# Altium project STM32F103RCT6_MCU_LAB.PrjPcb
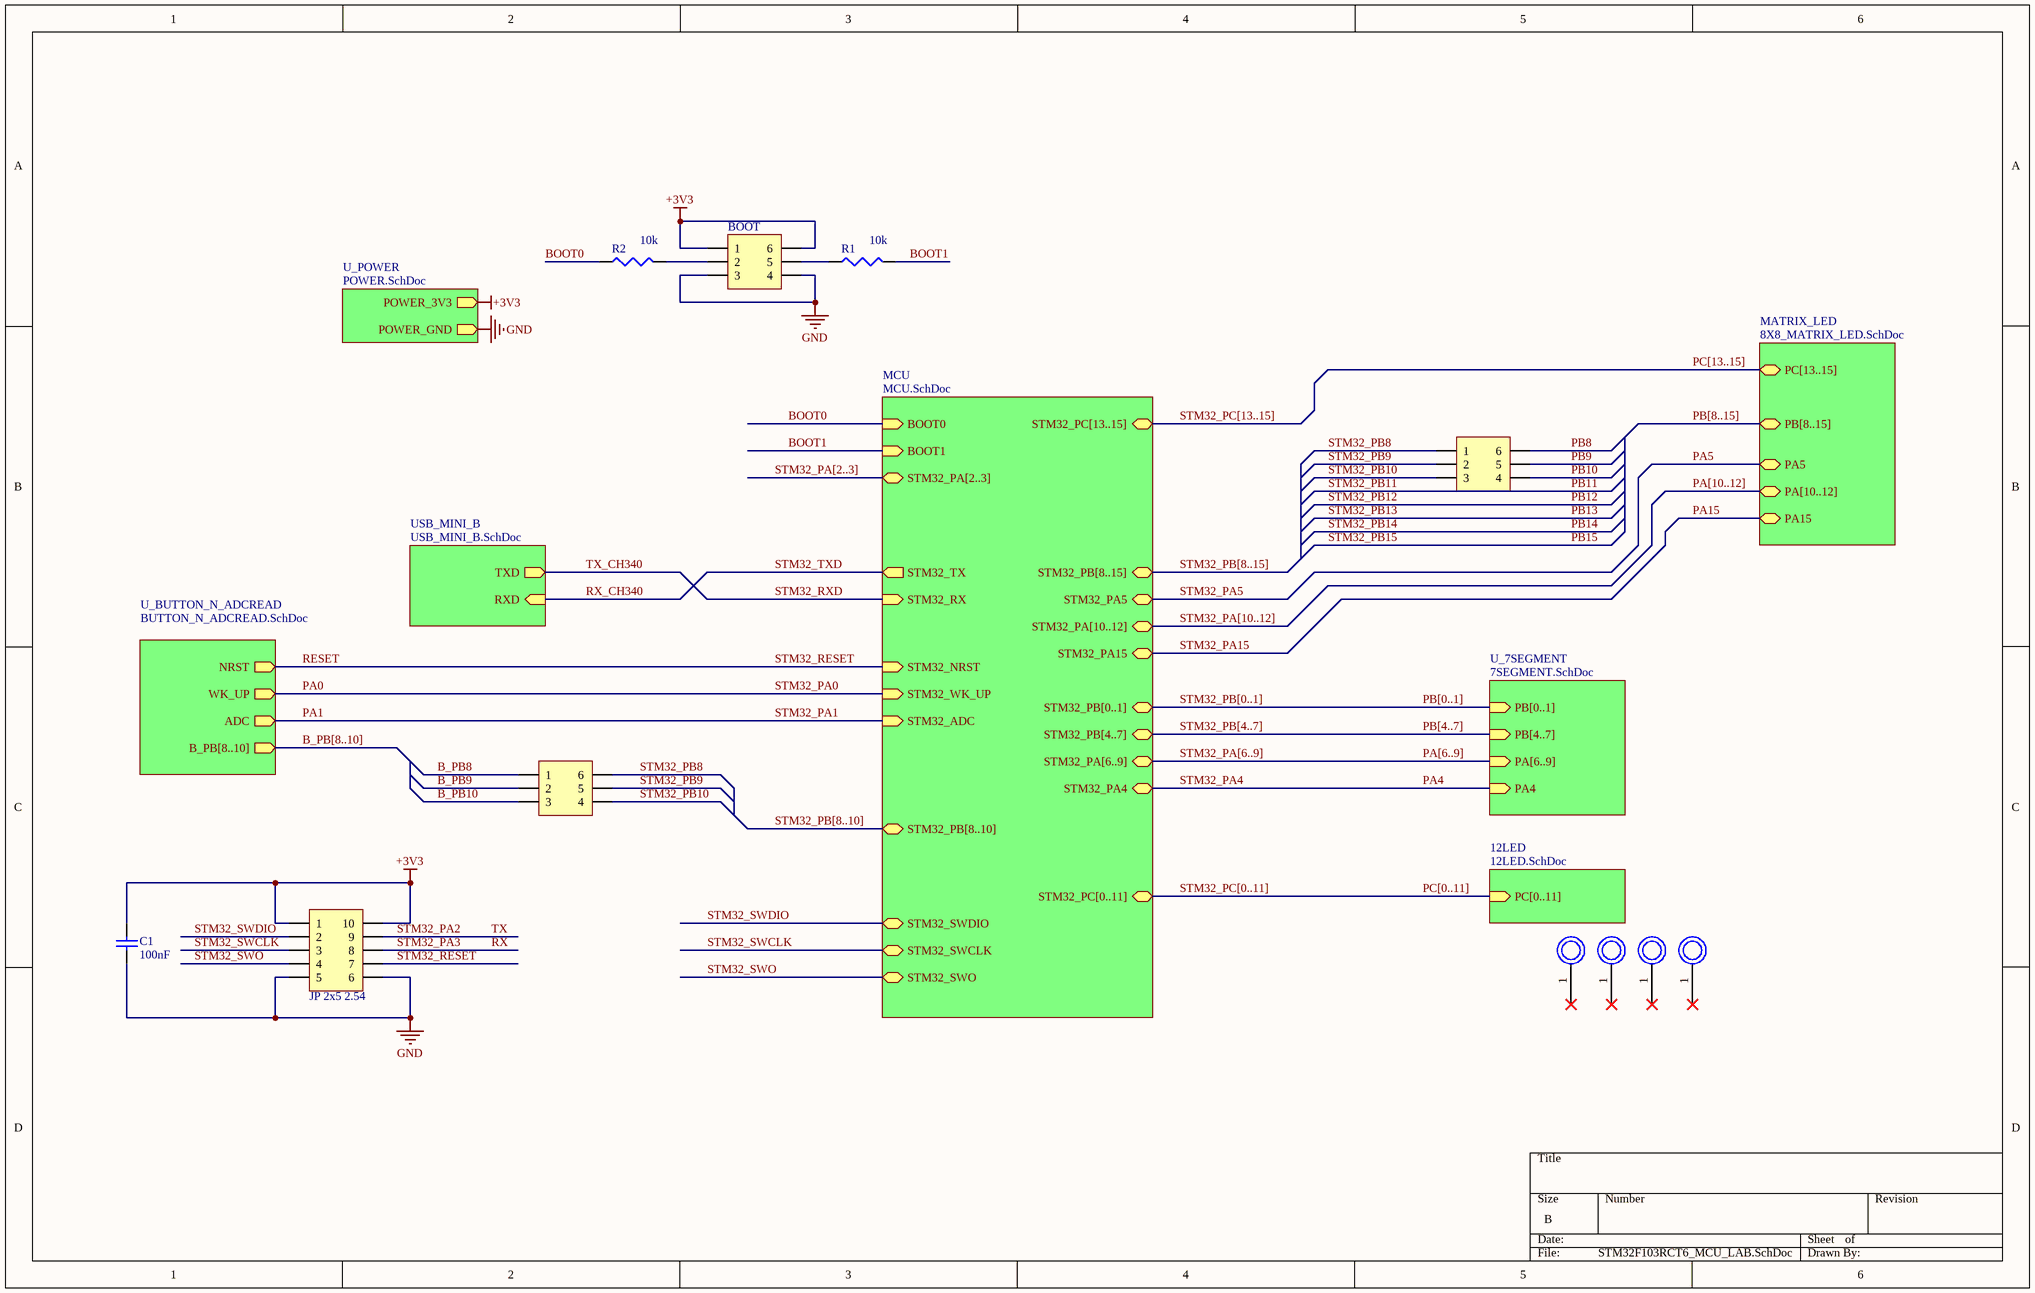
[diagram p0: STM32F103RCT6_MCU_LAB.SchDoc]
CAGE_CODE: ?????; CONTRACT_NUMBER: <CONTRACT NO>; DOC_NO_ASSY_DWG: <ASSY DWG NO>; DOC_NO_BOM: <BOM DOC NO>; DOC_NO_FAB_DWG: <FAB DWG NO>; DOC_NO_SCH_DWG: <SCH DWG NO>; PCB_2_DEC_TOL: +/-.01; PCB_3_DEC_TOL: +/-.010; PCB_ANG_TOL: +/-1/2; PCB_ASSEMBLY_NO: <PCB ASSY NO>; PCB_CHECKER: - -----; PCB_CHECKER_APP_DATE: --/--/----; PCB_DESIGNER: - -----; PCB_DESIGNER_APP_DATE: --/--/----; PCB_DWG_NO: <PCB DWG NO>; PCB_ENGINEER: - -----; PCB_ENGINEER_APP_DATE: --/--/----; PCB_PART_NUMBER: <PCB PN>; PCB_REV: A; SCH_REV: A
8 sheets, 145 parts. Net scope: hierarchical (ports join the sheet entries above them; power ports are global).
Board file: STM32F103RCT6_MCU_LAB_2.PcbDoc
Sheets:
  STM32F103RCT6_MCU_LAB.SchDoc
    MCU = MCU.SchDoc
    USB_MINI_B = USB_MINI_B.SchDoc
    12LED = 12LED.SchDoc
    MATRIX_LED = 8X8_MATRIX_LED.SchDoc
    U_7SEGMENT = 7SEGMENT.SchDoc
    U_BUTTON_N_ADCREAD = BUTTON_N_ADCREAD.SchDoc
    U_POWER = POWER.SchDoc

## Sheet STM32F103RCT6_MCU_LAB.SchDoc
size B; SheetNumber: 1; SheetTotal: 8

### Parts
BOOT  JP 2x3 2.54  [JP 2x3 DT]  (value not drawn)
C1  100nF  [CAPC0805(2012)145_L]
HOLE_M1  HOLE_M3  [HOLE M3]  (value not drawn)
HOLE_M2  HOLE_M3  [HOLE M3]  (value not drawn)
HOLE_M3  HOLE_M3  [HOLE M3]  (value not drawn)
HOLE_M4  HOLE_M3  [HOLE M3]  (value not drawn)
JP1  JP 2x3 2.54  [JP 2x3 DT]  (value not drawn)
JP2  JP 2x5 2.54  [JP 2x5 DT]
JP3  JP 2x3 2.54  [JP 2x3 DT]  (value not drawn)
R1  value 10k  [0805 (2012 Metric)]  (hidden comment: 1k)
R2  10k  [0805 (2012 Metric)]

### Sub-sheets
12LED = 12LED.SchDoc: PC[0..11] (in)
MATRIX_LED = 8X8_MATRIX_LED.SchDoc: PC[13..15] (bidir), PB[8..15] (bidir), PA5 (bidir), PA[10..12] (bidir), PA15 (bidir)
MCU = MCU.SchDoc: STM32_RX (in), STM32_TX (out), STM32_NRST (in), BOOT0 (in), STM32_PA[6..9] (bidir), STM32_PB[8..15] (bidir), STM32_WK_UP (in), STM32_PC[0..11] (bidir), STM32_ADC (in), STM32_PA5 (bidir), STM32_PB[4..7] (bidir), STM32_PA[2..3] (bidir), BOOT1 (in), STM32_PC[13..15] (bidir), STM32_PB[8..10] (bidir), STM32_SWDIO (bidir), STM32_SWCLK (bidir), STM32_PB[0..1] (bidir), STM32_PA[10..12] (bidir), STM32_PA15 (bidir), STM32_PA4 (bidir), STM32_SWO (bidir)
U_7SEGMENT = 7SEGMENT.SchDoc: PA[6..9] (in), PB[0..1] (in), PB[4..7] (in), PA4 (in)
U_BUTTON_N_ADCREAD = BUTTON_N_ADCREAD.SchDoc: B_PB[8..10] (out), NRST (out), WK_UP (out), ADC (out)
U_POWER = POWER.SchDoc: POWER_3V3 (out), POWER_GND (out)
USB_MINI_B = USB_MINI_B.SchDoc: TXD (out), RXD (in)

### Nets
+3V3: BOOT.1 BOOT.6 C1.2 JP2.1 JP2.10 ; sheet U_POWER/POWER_3V3
GND: BOOT.3 BOOT.4 C1.1 JP2.5 JP2.6 ; sheet U_POWER/POWER_GND
B_PB8: JP3.1
B_PB9: JP3.2
B_PB10: JP3.3
BOOT0: R2.1 ; sheet MCU/BOOT0
BOOT1: R1.2 ; sheet MCU/BOOT1
PA0: sheet MCU/STM32_WK_UP, sheet U_BUTTON_N_ADCREAD/WK_UP  [also labelled STM32_PA0]
PA1: sheet MCU/STM32_ADC, sheet U_BUTTON_N_ADCREAD/ADC  [also labelled STM32_PA1]
PA4: sheet MCU/STM32_PA4, sheet U_7SEGMENT/PA4  [also labelled STM32_PA4]
PA5: sheet MCU/STM32_PA5, sheet MATRIX_LED/PA5  [also labelled STM32_PA5]
PA15: sheet MCU/STM32_PA15, sheet MATRIX_LED/PA15  [also labelled STM32_PA15]
PB8: JP1.6
PB9: JP1.5
PB10: JP1.4
RESET: JP2.7 ; sheet MCU/STM32_NRST, sheet U_BUTTON_N_ADCREAD/NRST  [also labelled STM32_RESET]
RX: JP2.8  [also labelled STM32_PA3]
RX_CH340: sheet MCU/STM32_TX, sheet USB_MINI_B/RXD  [also labelled STM32_TXD]
STM32_PA2: JP2.9  [also labelled TX]
STM32_PB8: JP1.1 JP3.6
STM32_PB9: JP1.2 JP3.5
STM32_PB10: JP1.3 JP3.4
STM32_RXD: sheet MCU/STM32_RX, sheet USB_MINI_B/TXD  [also labelled TX_CH340]
STM32_SWCLK: JP2.3 ; sheet MCU/STM32_SWCLK
STM32_SWDIO: JP2.2 ; sheet MCU/STM32_SWDIO
STM32_SWO: JP2.4 ; sheet MCU/STM32_SWO
NetBOOT_2: BOOT.2 R2.2
NetBOOT_5: BOOT.5 R1.1

Not connected (* = marked no-connect by the designer): HOLE_M1 1*; HOLE_M2 1*; HOLE_M3 1*; HOLE_M4 1*

### Buses and harness runs
bus B_PB[8..10] = sheet U_BUTTON_N_ADCREAD/B_PB[8..10]
bus PA[6..9] = STM32_PA[6..9] = sheet MCU/STM32_PA[6..9] = sheet U_7SEGMENT/PA[6..9]
bus PA[10..12] = STM32_PA[10..12] = sheet MATRIX_LED/PA[10..12] = sheet MCU/STM32_PA[10..12]
bus PB[0..1] = STM32_PB[0..1] = sheet MCU/STM32_PB[0..1] = sheet U_7SEGMENT/PB[0..1]
bus PB[4..7] = STM32_PB[4..7] = sheet MCU/STM32_PB[4..7] = sheet U_7SEGMENT/PB[4..7]
bus PB[8..15] = sheet MATRIX_LED/PB[8..15]
bus PC[0..11] = STM32_PC[0..11] = sheet 12LED/PC[0..11] = sheet MCU/STM32_PC[0..11]
bus PC[13..15] = STM32_PC[13..15] = sheet MATRIX_LED/PC[13..15] = sheet MCU/STM32_PC[13..15]
bus STM32_PA[2..3] = sheet MCU/STM32_PA[2..3]
bus STM32_PB[8..10] = sheet MCU/STM32_PB[8..10]
bus STM32_PB[8..15] = sheet MCU/STM32_PB[8..15]

### Library data of the parts
BOOT JP1 JP3 = JP 2x3 2.54 Duc Thang: Cắm; Ten_Linh_Kien: Jump Đôi Đực 2.54MM 2x40P Thẳng 11MM; Don_Vi: Con; Ma_Hang: MH002686; Ghi_Chu: *; Kieu_Chan: *; Chung_Loai: Cắm
C1 = CMP-001-00081-5: Chip Capacitor, 100nF +/-40%, 16V, 0805, Thickness 1.45 mm; Tolerance: 5%; Min Operating Temperature: -55°C; Case/Package: 0805; Pins: 2; Max Operating Temperature: 85°C; Voltage Rating: 16V; Mounting Technology: SMT; Value: 100nF
HOLE_M1-HOLE_M4 = CMP-012-000000-2: Source: HOLE_M3.SchLib; Design Item ID: HOLE_M3
JP2 = JP 2x5 2.54 Duc Thang: Cắm; Ten_Linh_Kien: Jump Đôi Đực 2.54MM 2x40P Thẳng 11MM; Don_Vi: Con; Ma_Hang: MH002686; Ghi_Chu: *; Kieu_Chan: *; Chung_Loai: Cắm
R1 R2 = CMP-009-00179-13: Oreki; ComponentLink1Description: DigiKey; RoHS Compliant: Yes; Mounting Technology: SMT; Pins: 2; Case/Package: Chip
  R2: Value: 10k

## Sheet MCU.SchDoc
size B; SheetNumber: 4; SheetTotal: 8
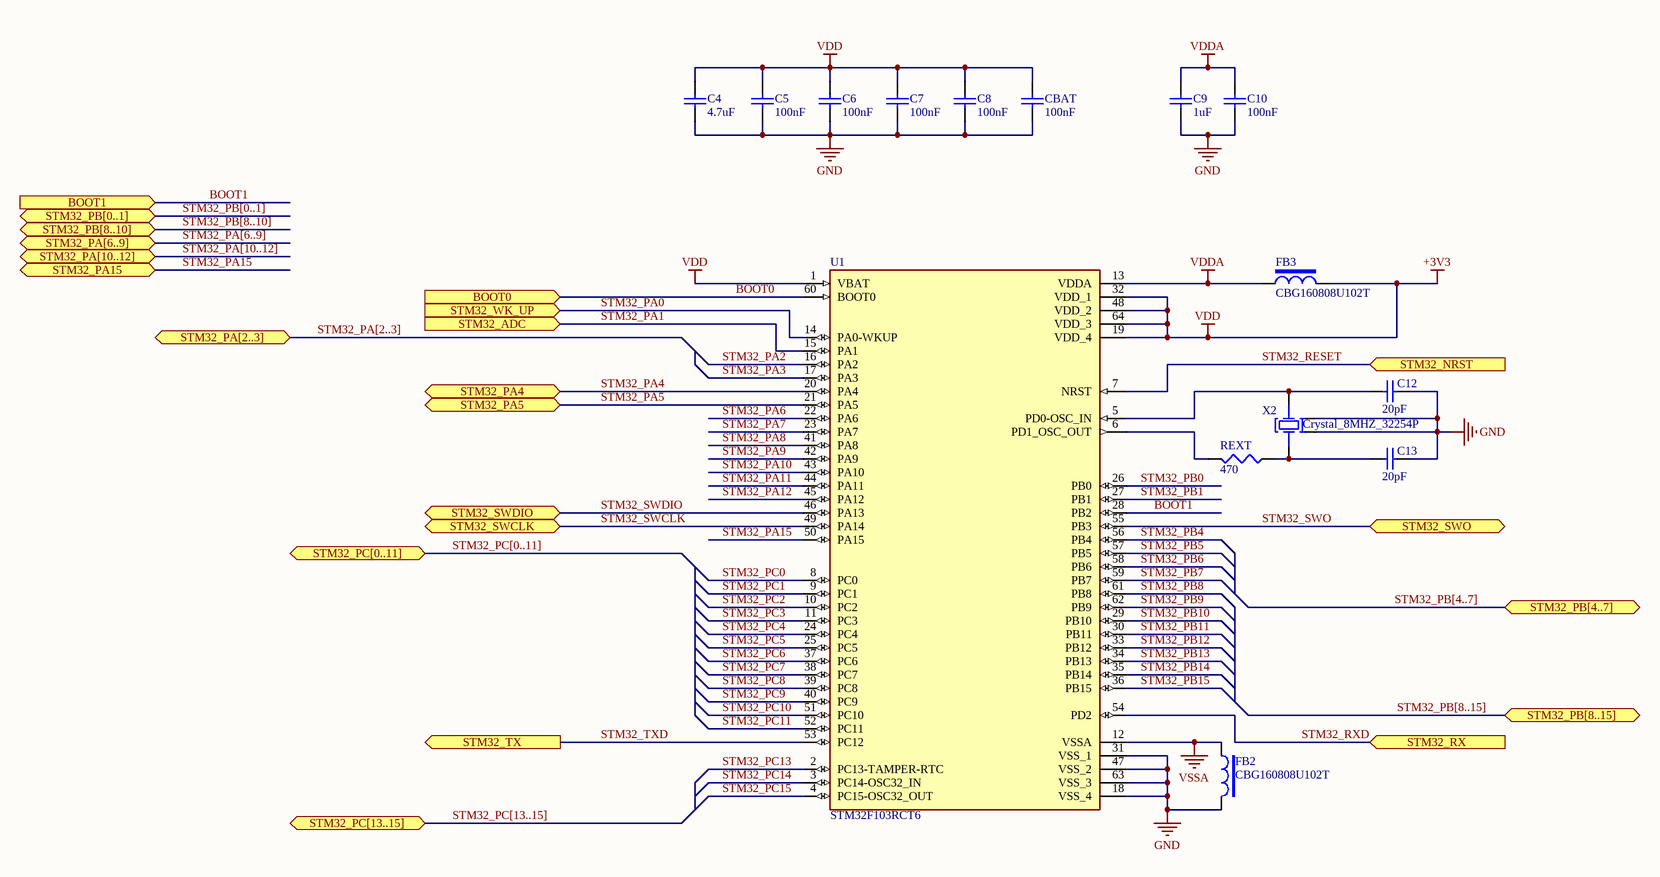
[diagram p1: MCU.SchDoc]

### Parts
C4  value 4.7uF  [CAPC0805(2012)145_L]  (hidden comment: 100nF)
C5  100nF  [CAPC0805(2012)145_L]
C6  100nF  [CAPC0805(2012)145_L]
C7  100nF  [CAPC0805(2012)145_L]
C8  100nF  [CAPC0805(2012)145_L]
C9  value 1uF  [CAPC0805(2012)145_L]  (hidden comment: 100nF)
C10  100nF  [CAPC0805(2012)145_L]
C12  value 20pF  [CAPC0805(2012)145_L]  (hidden comment: 22uF)
C13  value 20pF  [CAPC0805(2012)145_L]  (hidden comment: 22uF)
CBAT  100nF  [CAPC0805(2012)145_L]
FB2  CBG160808U102T  [0603]
FB3  CBG160808U102T  [0603]
REXT  value 470  [0805 (2012 Metric)]  (hidden comment: 220)
U1  STM32F103RCT6  [QFP50P1200X1200X160-64N]
X2  Crystal_8MHZ_32254P  [4-SMD, No Lead (3.2mm x 2.5mm)]

### Ports
BOOT0 (in), BOOT1 (in), STM32_ADC (in), STM32_NRST (in), STM32_PA4 (bidir), STM32_PA5 (bidir), STM32_PA15 (bidir), STM32_PA[2..3] (bidir), STM32_PA[6..9] (bidir), STM32_PA[10..12] (bidir), STM32_PB[0..1] (bidir), STM32_PB[4..7] (bidir), STM32_PB[8..10] (bidir), STM32_PB[8..15] (bidir), STM32_PC[0..11] (bidir), STM32_PC[13..15] (bidir), STM32_RX (in), STM32_SWCLK (bidir), STM32_SWDIO (bidir), STM32_SWO (bidir), STM32_TX (out), STM32_WK_UP (in)

### Nets
+3V3: C4.2 C5.2 C6.2 C7.2 C8.2 CBAT.2 FB3.2 U1.1(VBAT) U1.19(VDD_4) U1.32(VDD_1) U1.48(VDD_2) U1.64(VDD_3)  [also labelled VDD]
GND: C4.1 C5.1 C6.1 C7.1 C8.1 C9.1 C10.1 C12.2 C13.2 CBAT.1 FB2.2 U1.18(VSS_4) U1.31(VSS_1) U1.47(VSS_2) U1.63(VSS_3) X2.2(GND) X2.4(GND)
VDDA: C9.2 C10.2 FB3.1 U1.13(VDDA)
VSSA: FB2.1 U1.12(VSSA)
BOOT0: U1.60(BOOT0) ; port BOOT0
BOOT1: U1.28(PB2) ; port BOOT1
STM32_PA0: U1.14(PA0-WKUP) ; port STM32_WK_UP  [project net PA0]
STM32_PA1: U1.15(PA1) ; port STM32_ADC  [project net PA1]
STM32_PA2: U1.16(PA2)
STM32_PA3: U1.17(PA3)  [project net RX]
STM32_PA4: U1.20(PA4) ; port STM32_PA4  [project net PA4]
STM32_PA5: U1.21(PA5) ; port STM32_PA5  [project net PA5]
STM32_PA6: U1.22(PA6)  [project net PA6]
STM32_PA7: U1.23(PA7)  [project net PA7]
STM32_PA8: U1.41(PA8)  [project net PA8]
STM32_PA9: U1.42(PA9)  [project net PA9]
STM32_PA10: U1.43(PA10)  [project net PA10]
STM32_PA11: U1.44(PA11)  [project net PA11]
STM32_PA12: U1.45(PA12)  [project net PA12]
STM32_PA15: U1.50(PA15) ; port STM32_PA15  [project net PA15]
STM32_PB0: U1.26(PB0)  [project net PB0]
STM32_PB1: U1.27(PB1)  [project net PB1]
STM32_PB4: U1.56(PB4)  [project net PB4]
STM32_PB5: U1.57(PB5)  [project net PB5]
STM32_PB6: U1.58(PB6)  [project net PB6]
STM32_PB7: U1.59(PB7)  [project net PB7]
STM32_PB8: U1.61(PB8)
STM32_PB9: U1.62(PB9)
STM32_PB10: U1.29(PB10)
STM32_PB11: U1.30(PB11)  [project net PB11]
STM32_PB12: U1.33(PB12)  [project net PB12]
STM32_PB13: U1.34(PB13)  [project net PB13]
STM32_PB14: U1.35(PB14)  [project net PB14]
STM32_PB15: U1.36(PB15)  [project net PB15]
STM32_PC0: U1.8(PC0)  [project net PC0]
STM32_PC1: U1.9(PC1)  [project net PC1]
STM32_PC2: U1.10(PC2)  [project net PC2]
STM32_PC3: U1.11(PC3)  [project net PC3]
STM32_PC4: U1.24(PC4)  [project net PC4]
STM32_PC5: U1.25(PC5)  [project net PC5]
STM32_PC6: U1.37(PC6)  [project net PC6]
STM32_PC7: U1.38(PC7)  [project net PC7]
STM32_PC8: U1.39(PC8)  [project net PC8]
STM32_PC9: U1.40(PC9)  [project net PC9]
STM32_PC10: U1.51(PC10)  [project net PC10]
STM32_PC11: U1.52(PC11)  [project net PC11]
STM32_PC13: U1.2(PC13-TAMPER-RTC)  [project net PC13]
STM32_PC14: U1.3(PC14-OSC32_IN)  [project net PC14]
STM32_PC15: U1.4(PC15-OSC32_OUT)  [project net PC15]
STM32_RESET: U1.7(NRST) ; port STM32_NRST  [project net RESET]
STM32_RXD: U1.54(PD2) ; port STM32_RX
STM32_SWCLK: U1.49(PA14) ; port STM32_SWCLK
STM32_SWDIO: U1.46(PA13) ; port STM32_SWDIO
STM32_SWO: U1.55(PB3) ; port STM32_SWO
STM32_TXD: U1.53(PC12) ; port STM32_TX  [project net RX_CH340]
NetC12_1: C12.1 U1.5(PD0-OSC_IN) X2.3
NetC13_1: C13.1 REXT.1 X2.1
NetREXT_2: REXT.2 U1.6(PD1_OSC_OUT)

### Buses and harness runs
bus STM32_PA[2..3] = port STM32_PA[2..3]
bus STM32_PA[6..9] = port STM32_PA[6..9]
bus STM32_PA[10..12] = port STM32_PA[10..12]
bus STM32_PB[0..1] = port STM32_PB[0..1]
bus STM32_PB[4..7] = port STM32_PB[4..7]
bus STM32_PB[8..10] = port STM32_PB[8..10]
bus STM32_PB[8..15] = port STM32_PB[8..15]
bus STM32_PC[0..11] = port STM32_PC[0..11]
bus STM32_PC[13..15] = port STM32_PC[13..15]

### Library data of the parts
C4-C10 CBAT = CMP-001-00081-5: as C1 on sheet STM32F103RCT6_MCU_LAB; Min Operating Temperature: -55°C; Case/Package: 0805; Pins: 2; Max Operating Temperature: 85°C; Voltage Rating: 16V; Mounting Technology: SMT
  C5-C8 C10 CBAT: Value: 100nF
C12 C13 = CMP-001-00081-5: Chip Capacitor, 22µF +/-40%, 16V, 0805, Thickness 1.45 mm; Tolerance: 5%; Min Operating Temperature: -55°C; Case/Package: 0805; Pins: 2; Max Operating Temperature: 85°C; Voltage Rating: 16V; Mounting Technology: SMT
FB2 FB3 = CMP-005-00013-18: Oreki; ComponentLink1Description: DigiKey; JLCPCB Part #: C98501; Source: components.SchLib
REXT = CMP-009-00179-13: Oreki; ComponentLink1Description: DigiKey; RoHS Compliant: Yes; Mounting Technology: SMT; Pins: 2; Case/Package: Chip
U1 = CMP-031-00008-7: ARMÂ® CortexÂ®-M3 STM32F1 Microcontroller IC 32-Bit 72MHz 256KB (256K x 8) FLASH 64-LQFP (10x10); MF: STMicroelectronics; Check_prices: https://www.snapeda.com/parts/STM32F103RCT6/STMicroelectronics/view-part/?ref=eda; Value: *; Design Item ID: STM32F103RCT6; Availability: In Stock; Source: STM32F103RCT6.SchLib; Purchase-URL: https://pricing.snapeda.com/search/part/STM32F103RCT6/?ref=eda; Component Type: Standard; SnapEDA_Link: https://www.snapeda.com/parts/STM32F103RCT6/STMicroelectronics/view-part/?ref=snap; Price: None; Pins: 64; MP: STM32F103RCT6; Case/Package: LQFP-64 STMicroelectronics; JLCPCB Part #: C8323
X2 = CMP-003-00036-1: SMD3225-4P; ComponentLink1Description: DigiKey; JLCPCB Part #: C2682774

## Sheet USB_MINI_B.SchDoc
size A4; SheetNumber: 2; SheetTotal: 8
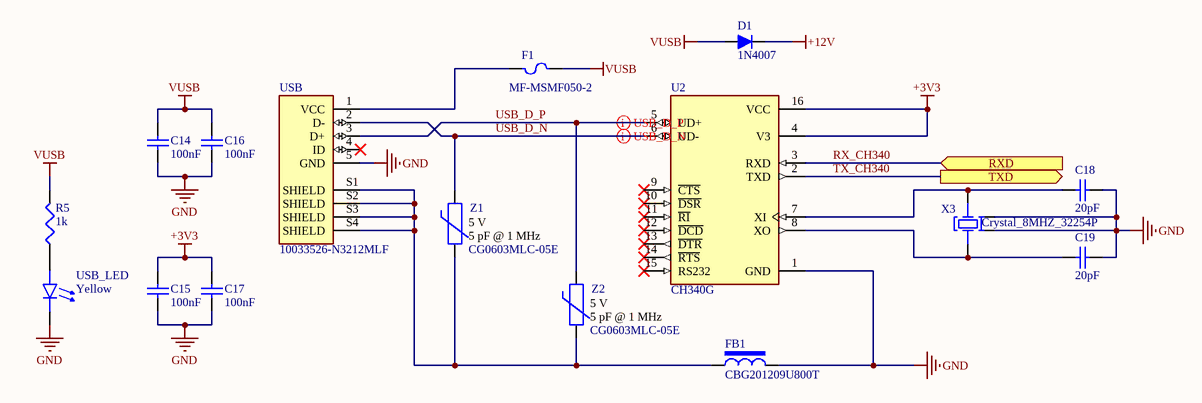
[diagram p2: USB_MINI_B.SchDoc]

### Parts
C14  100nF  [CAPC0805(2012)145_L]
C15  100nF  [CAPC0805(2012)145_L]
C16  100nF  [CAPC0805(2012)145_L]
C17  100nF  [CAPC0805(2012)145_L]
C18  value 20pF  [CAPC0805(2012)145_L]  (hidden comment: 22uF)
C19  value 20pF  [CAPC0805(2012)145_L]  (hidden comment: 22uF)
D1  1N4007  [1N4007]
F1  MF-MSMF050-2  [1812 (4532 Metric), Concave]
FB1  CBG201209U800T  [0805 (2012 Metric)]
R5  1k  [0805 (2012 Metric)]
U2  CH340G  [SOIC127P600X180-16N]
USB  10033526-N3212MLF  [AMPHENOL_10033526-N3212MLF]
USB_LED  Yellow  [0805 (2012 Metric) Yellow]
X3  Crystal_8MHZ_32254P  [4-SMD, No Lead (3.2mm x 2.5mm)]
Z1  Capacitance @ Frequency: 5 pF @ 1 MHz  Maximum DC Volts: 5 V  [0603 (1608 Metric)]  (hidden comment: CG0603MLC-05E)
Z2  Capacitance @ Frequency: 5 pF @ 1 MHz  Maximum DC Volts: 5 V  [0603 (1608 Metric)]  (hidden comment: CG0603MLC-05E)

### Ports
RXD (in), TXD (out)

### Nets
+3V3: C15.2 C17.2 U2.4(V3) U2.16(VCC)
+12V: D1.1
GND: C14.1 C15.1 C16.1 C17.1 C18.2 C19.2 FB1.2 U2.1(GND) USB.5(GND) USB_LED.1(K) X3.2(GND) X3.4(GND)
VUSB: C14.2 C16.2 D1.2 F1.2 R5.2
RX_CH340: U2.3(RXD) ; port RXD
TX_CH340: U2.2(TXD) ; port TXD  [project net STM32_RXD]
USB_D_N: U2.6(UD-) USB.2(D-) Z1.1
USB_D_P: U2.5(UD+) USB.3(D+) Z2.1
NetC18_1: C18.1 U2.7(XI) X3.3
NetC19_1: C19.1 U2.8(XO) X3.1
NetF1_1: F1.1 USB.1(VCC)
NetFB1_1: FB1.1 USB.S1(SHIELD) USB.S2(SHIELD) USB.S3(SHIELD) USB.S4(SHIELD) Z1.2 Z2.2
NetR5_1: R5.1 USB_LED.2(A)

Not connected (* = marked no-connect by the designer): U2 9(~{CTS})* 10(~{DSR})* 11(~{RI})* 12(~{DCD})* 13(~{DTR})* 14(~{RTS})* 15(RS232)*; USB 4(ID)*

### Layout directives
differential pair: USB_D_N, USB_D_P

### Library data of the parts
C14-C17 = CMP-001-00081-5: as C1 on sheet STM32F103RCT6_MCU_LAB; Min Operating Temperature: -55°C; Case/Package: 0805; Pins: 2; Max Operating Temperature: 85°C; Voltage Rating: 16V; Mounting Technology: SMT; Value: 100nF
C18 C19 = CMP-001-00081-5: as C12 on sheet MCU; Min Operating Temperature: -55°C; Case/Package: 0805; Pins: 2; Max Operating Temperature: 85°C; Voltage Rating: 16V; Mounting Technology: SMT
D1 = CMP-004-00031-1: Design Item ID: diode; Source: components.SchLib; JLCPCB Part #: C95872
F1 = CMP-006-000000-1: https://www.thegioiic.com/mf-msmf050-2-cau-chi-tu-phuc-hoi-1812-15v-0-5a; Voltage - Max: 15V; Current - Hold (Ih) (Max): 500 mA; Current - Trip (It): 1 A; Current - Max: 100 A; Time to Trip: 150 ms; Resistance - Initial (Ri) (Min): 150 mOhms; Resistance - Post Trip (R1) (Max): 1 Ohms; Part Number: MF-MSMF050-2; JLCPCB Part #: C17313; Design Item ID: CMP-005-00015-2; Pin Count: 2; Component Type: Fuses; Source: [CO2037] Power Consumption Calculator Arduino Board.SCHLIB
FB1 = CMP-005-00013-18: ComponentLink1Description: DigiKey; JLCPCB Part #: C139149; Source: components.SchLib; Design Item ID: CBG201209U800T
R5 = CMP-009-00179-13: Oreki; Value: 1k; ComponentLink1Description: DigiKey; RoHS Compliant: Yes; Mounting Technology: SMT; Pins: 2; Case/Package: Chip
U2 = CMP-012-000000-5: USB Interface Integrated Circuit; MF: WCH; Source: CH340G.SchLib; Availability: Not in stock; Component Type: Standard; Pin Count: 16; Price: None; Value: *; MP: Ch340G; Package: None; SnapEDA_Link: https://www.snapeda.com/parts/Ch340G/WCH/view-part/?ref=snap; Check_prices: https://www.snapeda.com/parts/Ch340G/WCH/view-part/?ref=eda; Design Item ID: CH340G
USB = CMP-037-000000-2: USB - mini B Receptacle Connector 5 Position Surface Mount, Right Angle; MF: Amphenol ICC; Value: *; Mouser-Purchase-URL: https://snapeda.com/shop?store=Mouser&id=47487; Package: None; Availability: Good; Component Type: Standard; MP: 10033526-N3212MLF; Source: 10033526-N3212MLF.SchLib; Price: None; Design Item ID: 10033526-N3212MLF; Pin Count: 9; Arrow_Electronics-Purchase-URL: https://snapeda.com/shop?store=Arrow+Electronics&id=47487; SnapEDA_Link: https://www.snapeda.com/parts/10033526-N3212MLF/Amphenol%20FCI/view-part/47487/?ref=snap; JLCPCB Part #: C2681563
USB_LED = CMP-007-00046-3: Oreki; JLCPCB Part #: C2296; ComponentLink1Description: DigiKey
X3 = CMP-003-00036-1: SMD3225-4P; ComponentLink1Description: DigiKey; JLCPCB Part #: C2682774
Z1 Z2 = CMP-009-000000-1: chua co link, xem tam: https://www.thegioiic.com/cg0603mlc-05e; Parameter 1: C840634; Energy: -; Part Number: CG0603MLC-05E; Design Item ID: CMP-001-00088-1; Source: [CO2037] Power Consumption Calculator Arduino Board.SCHLIB; Component Type: Capacitors; Pin Count: 2; JLCPCB Part #: C840634

## Sheet 12LED.SchDoc
size B; SheetNumber: 7; SheetTotal: 8
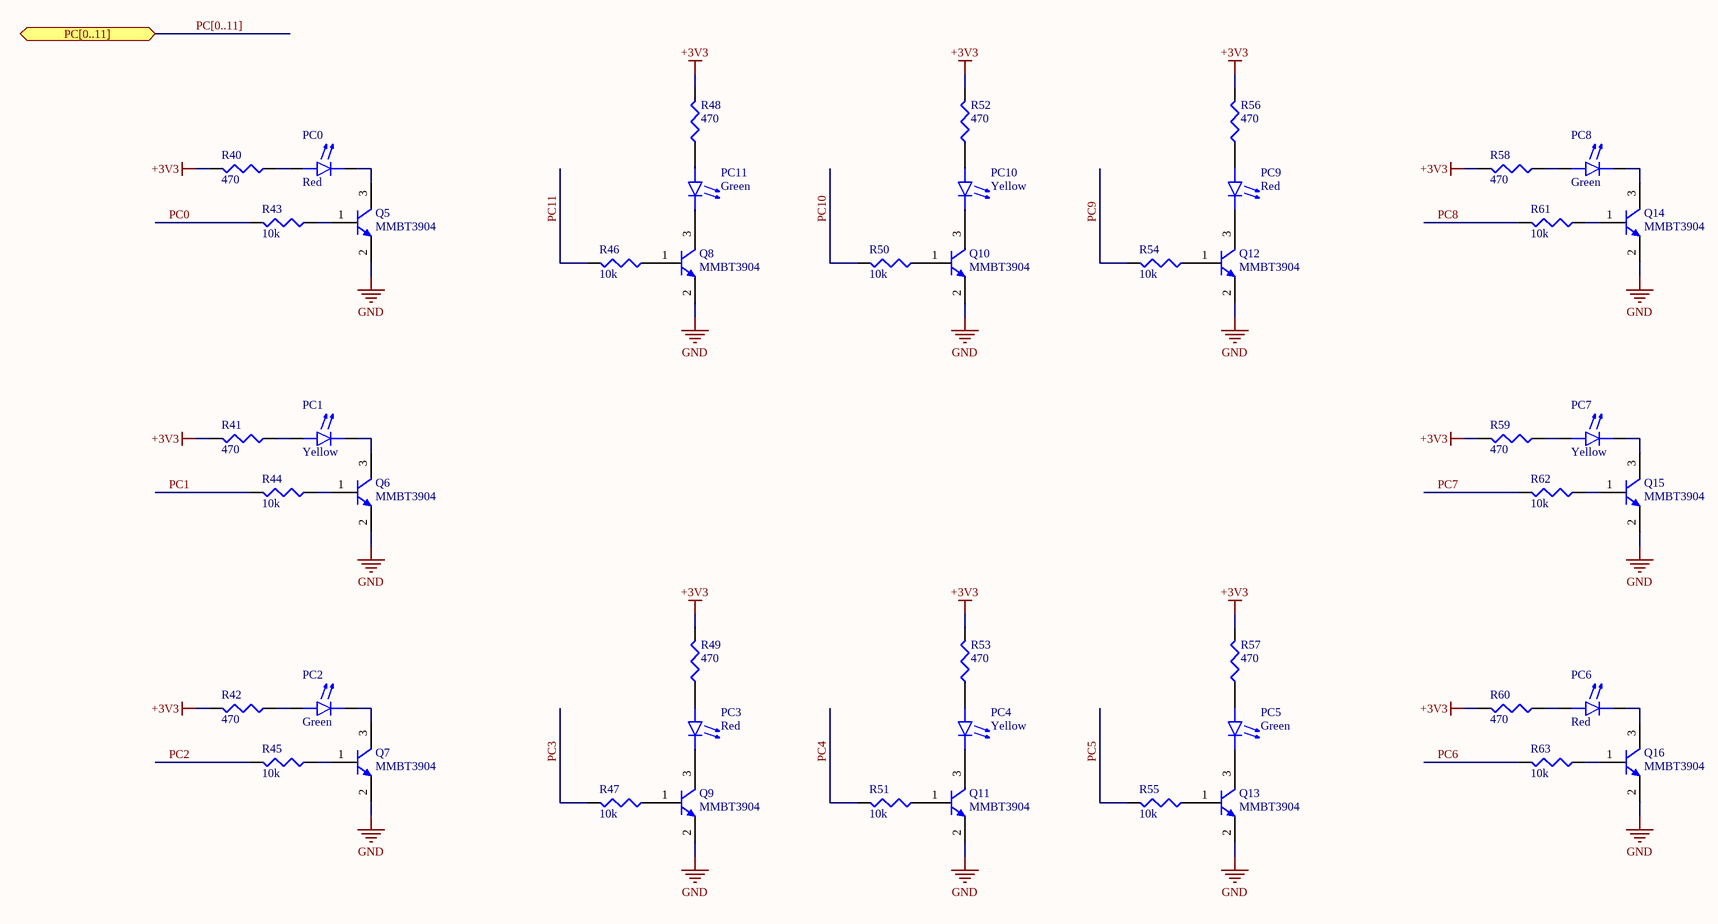
[diagram p3: 12LED.SchDoc]

### Parts
PC0  Red  [0805 (2012 Metric) Red]
PC1  Yellow  [0805 (2012 Metric) Yellow]
PC2  Green  [0805 (2012 Metric) Green]
PC3  Red  [0805 (2012 Metric) Red]
PC4  Yellow  [0805 (2012 Metric) Yellow]
PC5  Green  [0805 (2012 Metric) Green]
PC6  Red  [0805 (2012 Metric) Red]
PC7  Yellow  [0805 (2012 Metric) Yellow]
PC8  Green  [0805 (2012 Metric) Green]
PC9  Red  [0805 (2012 Metric) Red]
PC10  Yellow  [0805 (2012 Metric) Yellow]
PC11  Green  [0805 (2012 Metric) Green]
Q5  MMBT3904  [FAIR-SOT23-3_V]
Q6  MMBT3904  [FAIR-SOT23-3_V]
Q7  MMBT3904  [FAIR-SOT23-3_V]
Q8  MMBT3904  [FAIR-SOT23-3_V]
Q9  MMBT3904  [FAIR-SOT23-3_V]
Q10  MMBT3904  [FAIR-SOT23-3_V]
Q11  MMBT3904  [FAIR-SOT23-3_V]
Q12  MMBT3904  [FAIR-SOT23-3_V]
Q13  MMBT3904  [FAIR-SOT23-3_V]
Q14  MMBT3904  [FAIR-SOT23-3_V]
Q15  MMBT3904  [FAIR-SOT23-3_V]
Q16  MMBT3904  [FAIR-SOT23-3_V]
R40  value 470  [0805 (2012 Metric)]  (hidden comment: 220)
R41  value 470  [0805 (2012 Metric)]  (hidden comment: 220)
R42  value 470  [0805 (2012 Metric)]  (hidden comment: 220)
R43  value 10k  [0805 (2012 Metric)]  (hidden comment: 3k3)
R44  value 10k  [0805 (2012 Metric)]  (hidden comment: 3k3)
R45  value 10k  [0805 (2012 Metric)]  (hidden comment: 3k3)
R46  value 10k  [0805 (2012 Metric)]  (hidden comment: 3k3)
R47  value 10k  [0805 (2012 Metric)]  (hidden comment: 3k3)
R48  value 470  [0805 (2012 Metric)]  (hidden comment: 220)
R49  value 470  [0805 (2012 Metric)]  (hidden comment: 220)
R50  value 10k  [0805 (2012 Metric)]  (hidden comment: 3k3)
R51  value 10k  [0805 (2012 Metric)]  (hidden comment: 3k3)
R52  value 470  [0805 (2012 Metric)]  (hidden comment: 220)
R53  value 470  [0805 (2012 Metric)]  (hidden comment: 220)
R54  value 10k  [0805 (2012 Metric)]  (hidden comment: 3k3)
R55  value 10k  [0805 (2012 Metric)]  (hidden comment: 3k3)
R56  value 470  [0805 (2012 Metric)]  (hidden comment: 220)
R57  value 470  [0805 (2012 Metric)]  (hidden comment: 220)
R58  value 470  [0805 (2012 Metric)]  (hidden comment: 220)
R59  value 470  [0805 (2012 Metric)]  (hidden comment: 220)
R60  value 470  [0805 (2012 Metric)]  (hidden comment: 220)
R61  value 10k  [0805 (2012 Metric)]  (hidden comment: 3k3)
R62  value 10k  [0805 (2012 Metric)]  (hidden comment: 3k3)
R63  value 10k  [0805 (2012 Metric)]  (hidden comment: 3k3)

### Ports
PC[0..11] (bidir)

### Nets
+3V3: R40.2 R41.2 R42.2 R48.2 R49.2 R52.2 R53.2 R56.2 R57.2 R58.2 R59.2 R60.2
GND: Q5.2(E) Q6.2(E) Q7.2(E) Q8.2(E) Q9.2(E) Q10.2(E) Q11.2(E) Q12.2(E) Q13.2(E) Q14.2(E) Q15.2(E) Q16.2(E)
PC0: R43.2
PC1: R44.2
PC2: R45.2
PC3: R47.2
PC4: R51.2
PC5: R55.2
PC6: R63.2
PC7: R62.2
PC8: R61.2
PC9: R54.2
PC10: R50.2
PC11: R46.2
NetPC0_1: PC0.1(K) Q5.3(C)
NetPC0_2: PC0.2(A) R40.1
NetPC1_1: PC1.1(K) Q6.3(C)
NetPC1_2: PC1.2(A) R41.1
NetPC2_1: PC2.1(K) Q7.3(C)
NetPC2_2: PC2.2(A) R42.1
NetPC3_1: PC3.1(K) Q9.3(C)
NetPC3_2: PC3.2(A) R49.1
NetPC4_1: PC4.1(K) Q11.3(C)
NetPC4_2: PC4.2(A) R53.1
NetPC5_1: PC5.1(K) Q13.3(C)
NetPC5_2: PC5.2(A) R57.1
NetPC6_1: PC6.1(K) Q16.3(C)
NetPC6_2: PC6.2(A) R60.1
NetPC7_1: PC7.1(K) Q15.3(C)
NetPC7_2: PC7.2(A) R59.1
NetPC8_1: PC8.1(K) Q14.3(C)
NetPC8_2: PC8.2(A) R58.1
NetPC9_1: PC9.1(K) Q12.3(C)
NetPC9_2: PC9.2(A) R56.1
NetPC10_1: PC10.1(K) Q10.3(C)
NetPC10_2: PC10.2(A) R52.1
NetPC11_1: PC11.1(K) Q8.3(C)
NetPC11_2: PC11.2(A) R48.1
NetQ5_1: Q5.1(B) R43.1
NetQ6_1: Q6.1(B) R44.1
NetQ7_1: Q7.1(B) R45.1
NetQ8_1: Q8.1(B) R46.1
NetQ9_1: Q9.1(B) R47.1
NetQ10_1: Q10.1(B) R50.1
NetQ11_1: Q11.1(B) R51.1
NetQ12_1: Q12.1(B) R54.1
NetQ13_1: Q13.1(B) R55.1
NetQ14_1: Q14.1(B) R61.1
NetQ15_1: Q15.1(B) R62.1
NetQ16_1: Q16.1(B) R63.1

### Buses and harness runs
bus PC[0..11] = port PC[0..11]

### Library data of the parts
PC0-PC11 = CMP-007-00046-3: Oreki; ComponentLink1Description: DigiKey
  PC0 PC3 PC6 PC9: JLCPCB Part #: C142306
  PC1 PC4 PC7 PC10: JLCPCB Part #: C2296
  PC2 PC5 PC8 PC11: JLCPCB Part #: C389524
Q5-Q16 = CMP-014-00026-4: NPN General Purpose Amplifier, 40 V, 0.2 A, -55 to 150 degC, 3-Pin SOT23, RoHS, Tape and Reel; Manufacturer: Fairchild Semiconductor; Frequency: 300MHz; Elements: 1; Vce Max: 300mV; hFE Min: 100; Package Version: Rev. 12, 03/2016; Power: 625mW; Manufacturer URL: https://www.fairchildsemi.com/; JLCPCB Part #: C20526; Package Quantity: 3000; Case/Package: TO-236-3; Pins: 3; Package Reference: SOT23-3; Min Operating Temperature: -55°C; Package Description: 3-Pin Small Outline Transistor, Body 2.92 x 1.325 mm, Pitch 0.95 mm; Package URL: http://www.fairchildsemi.com/dwg/MA/MA03D.pdf; RoHS Compliant: True; Max Operating Temperature: 150°C; Mounting Technology: SM; Packaging: TapeandReel; Datasheet Version: Rev. 1.1.0, 10/2014; Datasheet URL: https://www.fairchildsemi.com/datasheets/MM/MMBT3904.pdf
R40-R63 = CMP-009-00179-13: Oreki; ComponentLink1Description: DigiKey; RoHS Compliant: Yes; Mounting Technology: SMT; Pins: 2; Case/Package: Chip

## Sheet 8X8_MATRIX_LED.SchDoc
size A4; SheetNumber: 6; SheetTotal: 8
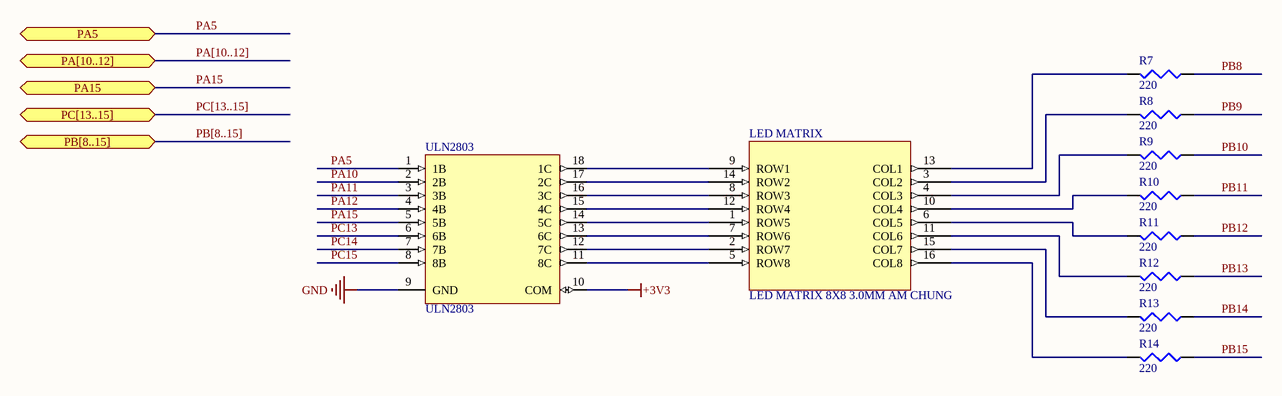
[diagram p4: 8X8_MATRIX_LED.SchDoc]

### Parts
LED_MATRIX  LED MATRIX 8X8 3.0MM AM CHUNG  [MATRIX LED 8X8 3.0mm]
R7  220  [0805 (2012 Metric)]
R8  220  [0805 (2012 Metric)]
R9  220  [0805 (2012 Metric)]
R10  220  [0805 (2012 Metric)]
R11  220  [0805 (2012 Metric)]
R12  220  [0805 (2012 Metric)]
R13  220  [0805 (2012 Metric)]
R14  220  [0805 (2012 Metric)]
ULN2803  ULN2803  [SOP18 - UMW]

### Ports
PA5 (bidir), PA15 (bidir), PA[10..12] (bidir), PB[8..15] (bidir), PC[13..15] (bidir)

### Nets
+3V3: ULN2803.10(COM)
GND: ULN2803.9(GND)
PA5: ULN2803.1(1B) ; port PA5
PA10: ULN2803.2(2B)
PA11: ULN2803.3(3B)
PA12: ULN2803.4(4B)
PA15: ULN2803.5(5B) ; port PA15
PB8: R7.1
PB9: R8.1
PB10: R9.1
PB11: R10.1
PB12: R11.1
PB13: R12.1
PB14: R13.1
PB15: R14.1
PC13: ULN2803.6(6B)
PC14: ULN2803.7(7B)
PC15: ULN2803.8(8B)
NetLED_MATRIX_1: LED_MATRIX.1(ROW5) ULN2803.14(5C)
NetLED_MATRIX_2: LED_MATRIX.2(ROW7) ULN2803.12(7C)
NetLED_MATRIX_3: LED_MATRIX.3(COL2) R8.2
NetLED_MATRIX_4: LED_MATRIX.4(COL3) R9.2
NetLED_MATRIX_5: LED_MATRIX.5(ROW8) ULN2803.11(8C)
NetLED_MATRIX_6: LED_MATRIX.6(COL5) R11.2
NetLED_MATRIX_7: LED_MATRIX.7(ROW6) ULN2803.13(6C)
NetLED_MATRIX_8: LED_MATRIX.8(ROW3) ULN2803.16(3C)
NetLED_MATRIX_9: LED_MATRIX.9(ROW1) ULN2803.18(1C)
NetLED_MATRIX_10: LED_MATRIX.10(COL4) R10.2
NetLED_MATRIX_11: LED_MATRIX.11(COL6) R12.2
NetLED_MATRIX_12: LED_MATRIX.12(ROW4) ULN2803.15(4C)
NetLED_MATRIX_13: LED_MATRIX.13(COL1) R7.2
NetLED_MATRIX_14: LED_MATRIX.14(ROW2) ULN2803.17(2C)
NetLED_MATRIX_15: LED_MATRIX.15(COL7) R13.2
NetLED_MATRIX_16: LED_MATRIX.16(COL8) R14.2

### Buses and harness runs
bus PA[10..12] = port PA[10..12]
bus PB[8..15] = port PB[8..15]
bus PC[13..15] = port PC[13..15]

### Library data of the parts
LED_MATRIX = CMP-007-000000-4: https://www.thegioiic.com/1088as-led-ma-tran-8x8-am-chung-mau-do-diem-dot-3-0mm; Source: LEDMATRIX8X8.SchLib; Design Item ID: D?; JLCPCB Part #: C2980922
R7-R14 = CMP-009-00179-13: Oreki; Value: 220; ComponentLink1Description: DigiKey; RoHS Compliant: Yes; Mounting Technology: SMT; Pins: 2; Case/Package: Chip
ULN2803 = CMP-014-00003-8: LLQT; ComponentLink3Description: DATASHEET UMW; ComponentLink1URL: https://datasheet.lcsc.com/lcsc/1810272108_Texas-Instruments-ULN2803ADWR_C9683.pdf; ComponentLink2URL: https://www.mouser.com/datasheet/2/408/ULN2803APG_datasheet_en_20121126-1224148.pdf; ComponentLink3URL: https://mm.digikey.com/Volume0/opasdata/d220001/medias/docus/5338/ULN2803.pdf; ComponentLink1Description: DATASHEET ADWR; ComponentLink2Description: DATASHEET APG; JLCPCB Part #: C5252904

## Sheet 7SEGMENT.SchDoc
size A4; SheetNumber: 5; SheetTotal: 8
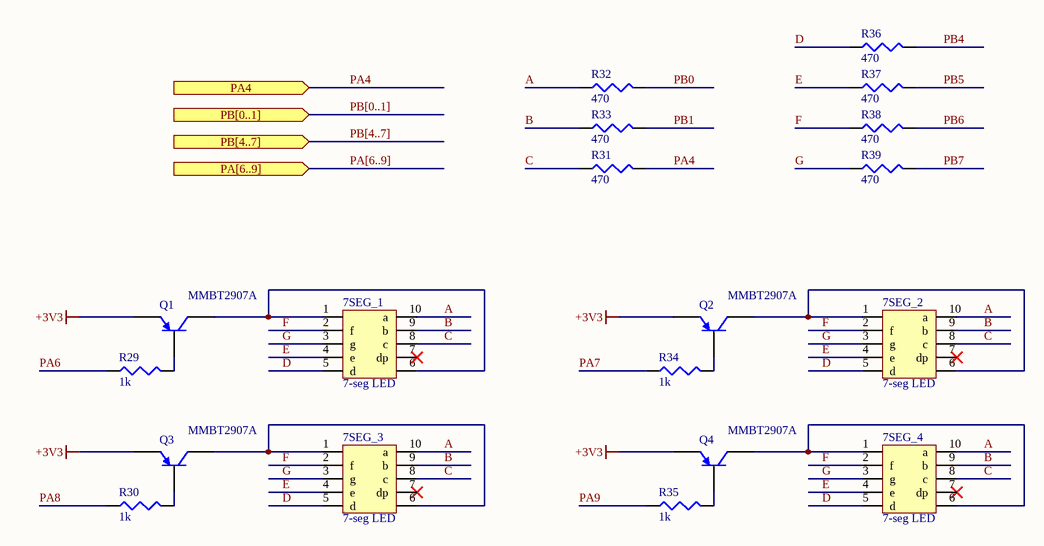
[diagram p5: 7SEGMENT.SchDoc]

### Parts
7SEG_1  7-seg LED  [7-seg LED 0.36inch]
7SEG_2  7-seg LED  [7-seg LED 0.36inch]
7SEG_3  7-seg LED  [7-seg LED 0.36inch]
7SEG_4  7-seg LED  [7-seg LED 0.36inch]
Q1  MMBT2907A  [FAIR-SOT23-3_V]
Q2  MMBT2907A  [FAIR-SOT23-3_V]
Q3  MMBT2907A  [FAIR-SOT23-3_V]
Q4  MMBT2907A  [FAIR-SOT23-3_V]
R29  1k  [0805 (2012 Metric)]
R30  1k  [0805 (2012 Metric)]
R31  470  [0805 (2012 Metric)]
R32  470  [0805 (2012 Metric)]
R33  470  [0805 (2012 Metric)]
R34  1k  [0805 (2012 Metric)]
R35  1k  [0805 (2012 Metric)]
R36  470  [0805 (2012 Metric)]
R37  470  [0805 (2012 Metric)]
R38  470  [0805 (2012 Metric)]
R39  470  [0805 (2012 Metric)]

### Ports
PA4 (in), PA[6..9] (in), PB[0..1] (in), PB[4..7] (in)

### Nets
+3V3: Q1.2(E) Q2.2(E) Q3.2(E) Q4.2(E)
A: 7SEG_1.10(a) 7SEG_2.10(a) 7SEG_3.10(a) 7SEG_4.10(a) R32.1
B: 7SEG_1.9(b) 7SEG_2.9(b) 7SEG_3.9(b) 7SEG_4.9(b) R33.1
C: 7SEG_1.8(c) 7SEG_2.8(c) 7SEG_3.8(c) 7SEG_4.8(c) R31.1
D: 7SEG_1.5(d) 7SEG_2.5(d) 7SEG_3.5(d) 7SEG_4.5(d) R36.1
E: 7SEG_1.4(e) 7SEG_2.4(e) 7SEG_3.4(e) 7SEG_4.4(e) R37.1
F: 7SEG_1.2(f) 7SEG_2.2(f) 7SEG_3.2(f) 7SEG_4.2(f) R38.1
G: 7SEG_1.3(g) 7SEG_2.3(g) 7SEG_3.3(g) 7SEG_4.3(g) R39.1
PA4: R31.2 ; port PA4
PA6: R29.1
PA7: R34.1
PA8: R30.1
PA9: R35.1
PB0: R32.2
PB1: R33.2
PB4: R36.2
PB5: R37.2
PB6: R38.2
PB7: R39.2
Net7SEG_1_1: 7SEG_1.1 7SEG_1.6(VCC/GND) Q1.3(C)
Net7SEG_2_1: 7SEG_2.1 7SEG_2.6(VCC/GND) Q2.3(C)
Net7SEG_3_1: 7SEG_3.1 7SEG_3.6(VCC/GND) Q3.3(C)
Net7SEG_4_1: 7SEG_4.1 7SEG_4.6(VCC/GND) Q4.3(C)
NetQ1_1: Q1.1(B) R29.2
NetQ2_1: Q2.1(B) R34.2
NetQ3_1: Q3.1(B) R30.2
NetQ4_1: Q4.1(B) R35.2

Not connected (* = marked no-connect by the designer): 7SEG_1 7(dp)*; 7SEG_2 7(dp)*; 7SEG_3 7(dp)*; 7SEG_4 7(dp)*

### Buses and harness runs
bus PA[6..9] = port PA[6..9]
bus PB[0..1] = port PB[0..1]
bus PB[4..7] = port PB[4..7]

### Library data of the parts
7SEG_1-7SEG_4 = CMP-007-00037-2: Source: LEDs.SchLib; Design Item ID: 7-seg LED
Q1-Q4 = CMP-013-00008-4: Manufacturer: Fairchild; Power: 350mW; Package Version: Rev. 12, 03/2016; Vce Max: 400mV; hFE Min: 100; Elements: 1; Frequency: 250MHz; Package Quantity: 3000; Mounting Technology: SM; Case/Package: TO-236-3; Package Description: 3-Pin Small Outline Transistor, Body 2.92 x 1.325 mm, Pitch 0.95 mm; Package Reference: SOT23-3; Pins: 3; Datasheet Version: Rev. 1.2.2, 04/2014; Max Operating Temperature: 150°C; Min Operating Temperature: -55°C; Packaging: TapeandReel; RoHS Compliant: True; Datasheet URL: https://www.fairchildsemi.com/datasheets/MM/MMBT3906.pdf; JLCPCB Part #: C2972764
R29-R39 = CMP-009-00179-13: Oreki; ComponentLink1Description: DigiKey; RoHS Compliant: Yes; Mounting Technology: SMT; Pins: 2; Case/Package: Chip
  R29 R30 R34 R35: Value: 1k
  R31-R33 R36-R39: Value: 470

## Sheet BUTTON_N_ADCREAD.SchDoc
size A4; SheetNumber: 8; SheetTotal: 8
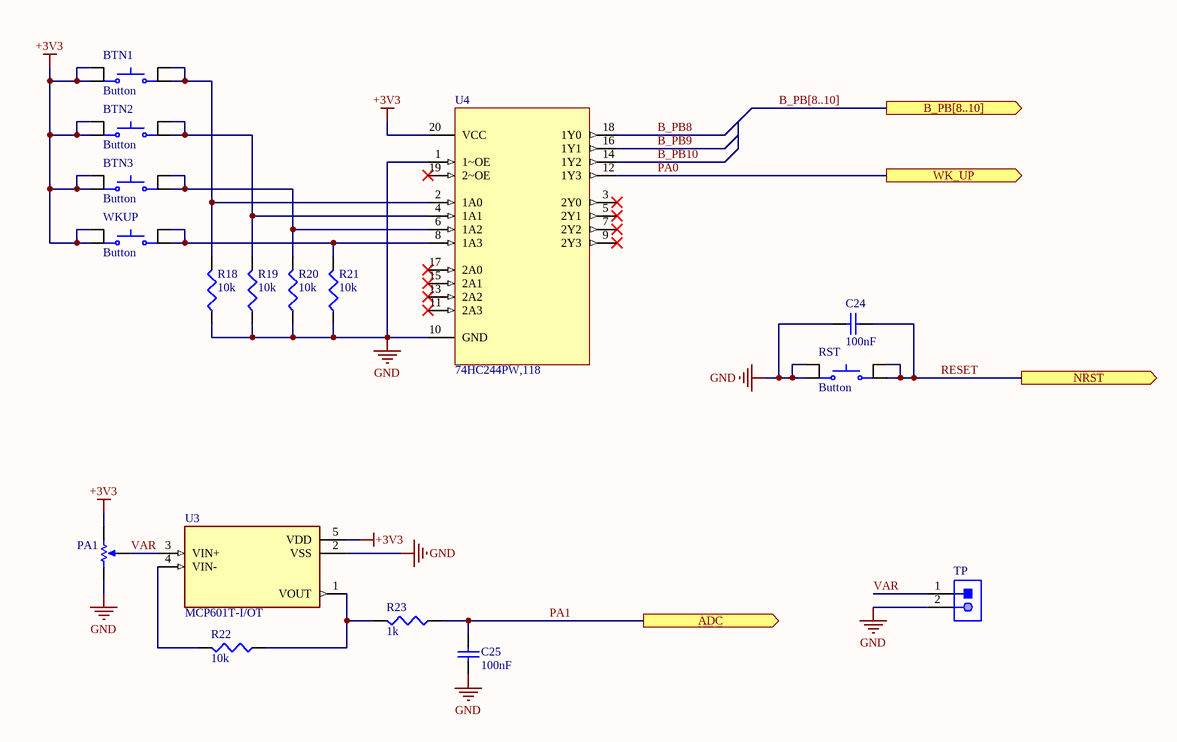
[diagram p6: BUTTON_N_ADCREAD.SchDoc]

### Parts
BTN1  Button  [SW_1571563-7]
BTN2  Button  [SW_1571563-7]
BTN3  Button  [SW_1571563-7]
C24  100nF  [CAPC0805(2012)145_L]
C25  100nF  [CAPC0805(2012)145_L]
PA1  3362P-1-104LF  [BOUR-3362P]  (value not drawn)
R18  10k  [0805 (2012 Metric)]
R19  10k  [0805 (2012 Metric)]
R20  10k  [0805 (2012 Metric)]
R21  10k  [0805 (2012 Metric)]
R22  10k  [0805 (2012 Metric)]
R23  value 1k  [0805 (2012 Metric)]  (hidden comment: 10k)
RST  Button  [SW_1571563-7]
TP  B2P-VH(LF)(SN)  [JST-B2P-VH(LF)(SN)_V]  (value not drawn)
U3  MCP601T-I/OT  [SOT95P280X145-5N]
U4  74HC244PW,118  [TSSOP-20]
WKUP  Button  [SW_1571563-7]

### Ports
ADC (out), B_PB[8..10] (out), NRST (out), WK_UP (out)

### Nets
+3V3: BTN1.1(COM) BTN1.2(COM) BTN2.1(COM) BTN2.2(COM) BTN3.1(COM) BTN3.2(COM) PA1.3(CW) U3.5(VDD) U4.20(VCC) WKUP.1(COM) WKUP.2(COM)
GND: C24.2 C25.1 PA1.1(CCW) R18.1 R19.1 R20.1 R21.1 RST.1(COM) RST.2(COM) TP.2 U3.2(VSS) U4.1(1~OE) U4.10(GND)
B_PB8: U4.18(1Y0)
B_PB9: U4.16(1Y1)
B_PB10: U4.14(1Y2)
PA0: U4.12(1Y3) ; port WK_UP
PA1: C25.2 R23.1 ; port ADC
RESET: C24.1 RST.3(NO) RST.4(NO) ; port NRST
VAR: PA1.2(S) TP.1 U3.3(VIN+)
NetBTN1_3: BTN1.3(NO) BTN1.4(NO) R18.2 U4.2(1A0)
NetBTN2_3: BTN2.3(NO) BTN2.4(NO) R19.2 U4.4(1A1)
NetBTN3_3: BTN3.3(NO) BTN3.4(NO) R20.2 U4.6(1A2)
NetR21_2: R21.2 U4.8(1A3) WKUP.3(NO) WKUP.4(NO)
NetR22_1: R22.1 R23.2 U3.1(VOUT)
NetR22_2: R22.2 U3.4(VIN-)

Not connected (* = marked no-connect by the designer): U4 3(2Y0)* 5(2Y1)* 7(2Y2)* 9(2Y3)* 11(2A3)* 13(2A2)* 15(2A1)* 17(2A0)* 19(2~OE)*

### Buses and harness runs
bus B_PB[8..10] = port B_PB[8..10]

### Library data of the parts
BTN1-BTN3 RST WKUP = CMP-011-00013-6: Switch Tactile OFF (ON) SPST Round Button Gull Wing 0.05A 24VDC 1VA 0.98N SMD Loose; MF: TE Connectivity; MP: 1571563-7; Price: None; SnapEDA_Link: https://www.snapeda.com/parts/1571563-7/TE%20Connectivity/view-part/2365663/?ref=snap; Value: *; Design Item ID: button; Availability: Unavailable; Source: others.SchLib; Case/Package: SMD-6 Omron Electronics; EU_RoHS_Compliance: Compliant; JLCPCB Part #: C592980
C24 C25 = CMP-001-00081-5: as C1 on sheet STM32F103RCT6_MCU_LAB; Min Operating Temperature: -55°C; Case/Package: 0805; Pins: 2; Max Operating Temperature: 85°C; Voltage Rating: 16V; Mounting Technology: SMT; Value: 100nF
PA1 = CMP-009-00040-2: Square Trimpot(R) Trimming Potentiometer, 100 KOhm, 300 V, -55 to 125 degC, 3-Pin THD, RoHS, Tube, https://www.thegioiic.com/3296x-104-bien-tro-100-kohm-3-chan-tinh-chinh-ngang-0-5w; Manufacturer: Bourns; Voltage Rating: 300V; Resistance: 100k; Power: 500mW; Tolerance: 10%; RoHS Compliant: True; Mounting Technology: TH; Datasheet URL: http://www.bourns.com/docs/Product-Datasheets/3362.pdf; Min Operating Temperature: -55°C; Composition: Potentiometer; Package Quantity: 250; Lead Pitch: 2.54mm; Case/Package: 3326P; Package Description: 3-Pin Through Hole Device, Body 6.6 x 6.99 mm, Pitch 2.54 mm; Datasheet Version: May-16; Packaging: Rail/Tube; Package Reference: 3326P; Manufacturer URL: http://www.bourns.com/; Max Operating Temperature: 125°C; JLCPCB Part #: C81266
R18-R23 = CMP-009-00179-13: Oreki; ComponentLink1Description: DigiKey; RoHS Compliant: Yes; Mounting Technology: SMT; Pins: 2; Case/Package: Chip
  R18-R22: Value: 10k
TP = CMP-002-00025-3: Manufacturer: JST; Gender: Male; Connector Type: Header; Datasheet URL: http://www.jst-mfg.com/product/pdf/eng/eVH.pdf; Datasheet Version: May-16; Package Reference: B2P-VH(LF)(SN); Max Operating Temperature: 85°C; RoHS Compliant: Unknown; Mounting Technology: TH; Package Description: Male Header, Pitch 3.96 mm, 1 x 2 Position, Height 10.9 mm, Tail Length 3.7 mm; Min Operating Temperature: -25°C; Manufacturer URL: http://www.jst.com/home2.html; Case/Package: B2P-VH(LF)(SN)
U3 = CMP-014-00006-3: General Purpose Amplifier 1 Circuit Rail-to-Rail SOT-23-5; MF: Microchip; Design Item ID: MCP601T-I/OT; SnapEDA_Link: https://www.snapeda.com/parts/MCP601T-I/OT/Microchip/view-part/43729/?ref=snap; Component Type: Standard; MP: MCP601T-I/OT; Price: None; Case/Package: SOT-23 Microchip; Pins: 5; Source: SnapEDAsch.SchLib; Value: *; Availability: Unavailable; JLCPCB Part #: C128440
U4 = CMP-003-000004-5: 4 7.8mA 2V~6V 7.8mA 2 TSSOP-20  Buffer/Driver/Transceiver ROHS; MP: altium_native_batch; JLCPCB Part #: C5623; Source: 74HC244D,653.SchLib; RoHS Compliant: Yes; Value: *; Availability: Unavailable; Pin Count: 20; Price: None; Component Type: Standard; Package: None; Design Item ID: 74HC244PW,118

## Sheet POWER.SchDoc
size A4; SheetNumber: 3; SheetTotal: 8
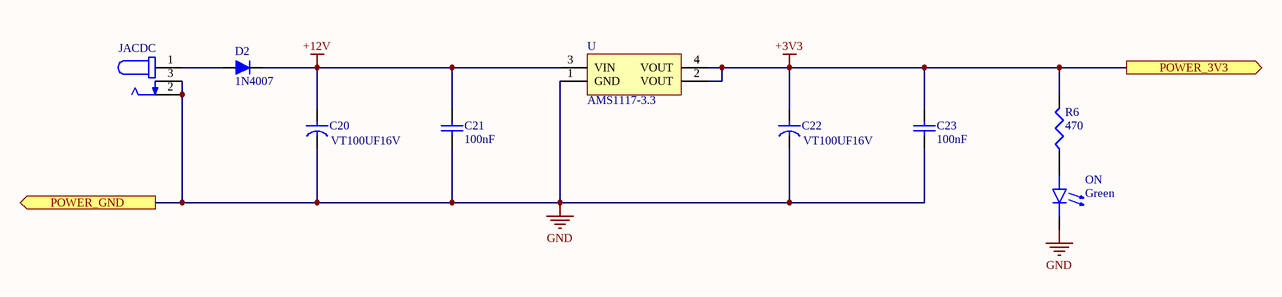
[diagram p7: POWER.SchDoc]

### Parts
C20  VT100UF16V  [SMD,D6.3xL5.4mm]
C21  100nF  [CAPC0805(2012)145_L]
C22  VT100UF16V  [SMD,D6.3xL5.4mm]
C23  100nF  [CAPC0805(2012)145_L]
D2  1N4007  [1N4007]
JACDC  DCJ200-10-A-XX-K_REVA  [GCT_DCJ200-10-A-XX-K_REVA]  (value not drawn)
ON  Green  [0805 (2012 Metric) Green]
R6  value 470  [0805 (2012 Metric)]  (hidden comment: 220)
U  AMS1117-3.3  [SOT229P700X180-4N]

### Ports
POWER_3V3 (out), POWER_GND (out)

### Nets
+3V3: C22.1 C23.2 R6.2 U.2(VOUT) U.4(VOUT) ; port POWER_3V3
+12V: C20.1 C21.2 D2.1 U.3(VIN)
GND: C20.2 C21.1 C22.2 C23.1 JACDC.2 JACDC.3 ON.1(K) U.1(GND) ; port POWER_GND
NetD2_2: D2.2 JACDC.1
NetON_2: ON.2(A) R6.1

### Library data of the parts
C20 C22 = CMP-001-00092-1: 100uF 16V 60mA@120Hz ±20% SMD,D6.3xL5.4mm  Aluminum Electrolytic Capacitors - SMD ROHS; JLCPCB Part #: C5246579; ComponentLink1Description: DigiKey; ComponentLink2Description: thegioiic
C21 C23 = CMP-001-00081-5: as C1 on sheet STM32F103RCT6_MCU_LAB; Min Operating Temperature: -55°C; Case/Package: 0805; Pins: 2; Max Operating Temperature: 85°C; Voltage Rating: 16V; Mounting Technology: SMT; Value: 100nF
D2 = CMP-004-00031-1: Design Item ID: diode; Source: components.SchLib; JLCPCB Part #: C95872
JACDC = CMP-002-00071-1: Power Barrel Connector Jack 2.05mm ID (0.081), 5.50mm OD (0.217) Through Hole, Right Angle; MP: DCJ200-10-A-K1-K; MF: Global Connector Technology; Value: *; Design Item ID: DCJ200-10-A-XX-K_REVA; Check_prices: https://www.snapeda.com/parts/DCJ200-10-A-K1-K/Global+Connector+Technology/view-part/?ref=eda; Component Type: Standard; Case/Package: None; Pins: 3; SnapEDA_Link: https://www.snapeda.com/parts/DCJ200-10-A-K1-K/Global+Connector+Technology/view-part/?ref=snap; Source: DCJ200-10-A-XX-K_REVA.SchLib
ON = CMP-007-00046-3: Oreki; JLCPCB Part #: C389524; ComponentLink1Description: DigiKey
R6 = CMP-009-00179-13: Oreki; ComponentLink1Description: DigiKey; RoHS Compliant: Yes; Mounting Technology: SMT; Pins: 2; Case/Package: Chip
U = CMP-019-00049-4: Oreki; ComponentLink2Description: thegioiic; ComponentLink1Description: DigiKey; JLCPCB Part #: C6186

## Nets that join several sheets
+3V3: STM32F103RCT6_MCU_LAB (5 pins), MCU (12 pins), USB_MINI_B (C15.2 C17.2 U2.4 U2.16), 12LED (12 pins), 8X8_MATRIX_LED (ULN2803.10), 7SEGMENT (Q1.2 Q2.2 Q3.2 Q4.2), BUTTON_N_ADCREAD (11 pins), POWER (5 pins)
+12V: USB_MINI_B (D1.1), POWER (C20.1 C21.2 D2.1 U.3)
GND: STM32F103RCT6_MCU_LAB (5 pins), MCU (17 pins), USB_MINI_B (12 pins), 12LED (12 pins), 8X8_MATRIX_LED (ULN2803.9), BUTTON_N_ADCREAD (13 pins), POWER (8 pins)
B_PB8: STM32F103RCT6_MCU_LAB (JP3.1), BUTTON_N_ADCREAD (U4.18)
B_PB9: STM32F103RCT6_MCU_LAB (JP3.2), BUTTON_N_ADCREAD (U4.16)
B_PB10: STM32F103RCT6_MCU_LAB (JP3.3), BUTTON_N_ADCREAD (U4.14)
BOOT0: STM32F103RCT6_MCU_LAB (R2.1), MCU (U1.60)
BOOT1: STM32F103RCT6_MCU_LAB (R1.2), MCU (U1.28)
PA0: MCU (U1.14), BUTTON_N_ADCREAD (U4.12)
PA1: MCU (U1.15), BUTTON_N_ADCREAD (C25.2 R23.1)
PA4: MCU (U1.20), 7SEGMENT (R31.2)
PA5: MCU (U1.21), 8X8_MATRIX_LED (ULN2803.1)
PA6: MCU (U1.22), 7SEGMENT (R29.1)
PA7: MCU (U1.23), 7SEGMENT (R34.1)
PA8: MCU (U1.41), 7SEGMENT (R30.1)
PA9: MCU (U1.42), 7SEGMENT (R35.1)
PA10: MCU (U1.43), 8X8_MATRIX_LED (ULN2803.2)
PA11: MCU (U1.44), 8X8_MATRIX_LED (ULN2803.3)
PA12: MCU (U1.45), 8X8_MATRIX_LED (ULN2803.4)
PA15: MCU (U1.50), 8X8_MATRIX_LED (ULN2803.5)
PB0: MCU (U1.26), 7SEGMENT (R32.2)
PB1: MCU (U1.27), 7SEGMENT (R33.2)
PB4: MCU (U1.56), 7SEGMENT (R36.2)
PB5: MCU (U1.57), 7SEGMENT (R37.2)
PB6: MCU (U1.58), 7SEGMENT (R38.2)
PB7: MCU (U1.59), 7SEGMENT (R39.2)
PB8: STM32F103RCT6_MCU_LAB (JP1.6), 8X8_MATRIX_LED (R7.1)
PB9: STM32F103RCT6_MCU_LAB (JP1.5), 8X8_MATRIX_LED (R8.1)
PB10: STM32F103RCT6_MCU_LAB (JP1.4), 8X8_MATRIX_LED (R9.1)
PB11: MCU (U1.30), 8X8_MATRIX_LED (R10.1)
PB12: MCU (U1.33), 8X8_MATRIX_LED (R11.1)
PB13: MCU (U1.34), 8X8_MATRIX_LED (R12.1)
PB14: MCU (U1.35), 8X8_MATRIX_LED (R13.1)
PB15: MCU (U1.36), 8X8_MATRIX_LED (R14.1)
PC0: MCU (U1.8), 12LED (R43.2)
PC1: MCU (U1.9), 12LED (R44.2)
PC2: MCU (U1.10), 12LED (R45.2)
PC3: MCU (U1.11), 12LED (R47.2)
PC4: MCU (U1.24), 12LED (R51.2)
PC5: MCU (U1.25), 12LED (R55.2)
PC6: MCU (U1.37), 12LED (R63.2)
PC7: MCU (U1.38), 12LED (R62.2)
PC8: MCU (U1.39), 12LED (R61.2)
PC9: MCU (U1.40), 12LED (R54.2)
PC10: MCU (U1.51), 12LED (R50.2)
PC11: MCU (U1.52), 12LED (R46.2)
PC13: MCU (U1.2), 8X8_MATRIX_LED (ULN2803.6)
PC14: MCU (U1.3), 8X8_MATRIX_LED (ULN2803.7)
PC15: MCU (U1.4), 8X8_MATRIX_LED (ULN2803.8)
RESET: STM32F103RCT6_MCU_LAB (JP2.7), MCU (U1.7), BUTTON_N_ADCREAD (C24.1 RST.3 RST.4)
RX: STM32F103RCT6_MCU_LAB (JP2.8), MCU (U1.17)
RX_CH340: MCU (U1.53), USB_MINI_B (U2.3)
STM32_PA2: STM32F103RCT6_MCU_LAB (JP2.9), MCU (U1.16)
STM32_PB8: STM32F103RCT6_MCU_LAB (JP1.1 JP3.6), MCU (U1.61)
STM32_PB9: STM32F103RCT6_MCU_LAB (JP1.2 JP3.5), MCU (U1.62)
STM32_PB10: STM32F103RCT6_MCU_LAB (JP1.3 JP3.4), MCU (U1.29)
STM32_RXD: MCU (U1.54), USB_MINI_B (U2.2)
STM32_SWCLK: STM32F103RCT6_MCU_LAB (JP2.3), MCU (U1.49)
STM32_SWDIO: STM32F103RCT6_MCU_LAB (JP2.2), MCU (U1.46)
STM32_SWO: STM32F103RCT6_MCU_LAB (JP2.4), MCU (U1.55)